# EAGLE schematic robot_general_purpose_board (EAGLE 7.1.0)
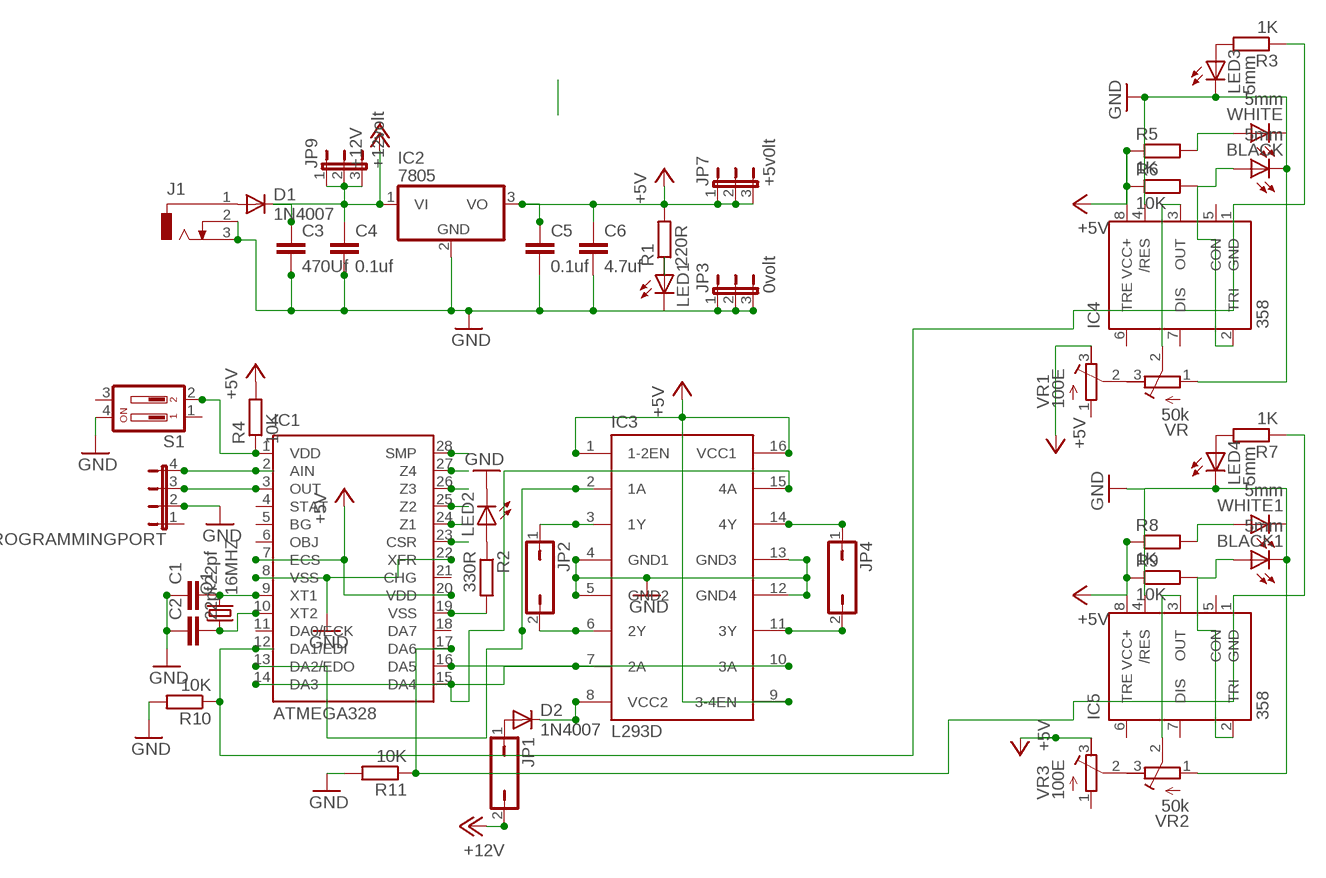
[diagram p0: schematic, sheet 1]

## Parts
BLACK  5mm  LED5MM  [LED5MM]
BLACK1  5mm  LED5MM  [LED5MM]
C1  22pf  C2.5/2  [C2.5-2]
C2  22pf  C2.5/2  [C2.5-2]
C3  470Uf  C2.5/2  [C2.5-2]
C4  0.1uf  C2.5/2  [C2.5-2]
C5  0.1uf  C2.5/2  [C2.5-2]
C6  4.7uf  C2.5/2  [C2.5-2]
D1  1N4007  1N4004  [DO41-10]
D2  1N4007  1N4004  [DO41-10]
IC1  ATMEGA328  QT9701BD  [DIL28-3]
IC2  7805  786TV  [TO220V]
IC3  L293D  [DIL16]
IC4  358  NE555  [DIL-08]
IC5  358  NE555  [DIL-08]
J1  DCJ0303  [DCJ0303]
JP1  JP1Q  [JP1]
JP2  JP1Q  [JP1]
JP3  0volt  JP2E  [JP2]
JP4  JP1Q  [JP1]
JP7  +5v0lt  JP2E  [JP2]
JP9  +12volt  JP2E  [JP2]
LED1  LED3MM  [LED3MM]
LED2  LED3MM  [LED3MM]
LED3  5mm  LED5MM  [LED5MM]
LED4  5mm  LED5MM  [LED5MM]
PROGRAMMINGPORT  JP4E  [JP4]
Q1  16MHZ  CRYSTALHC49S  [HC49/S]
R1  220R  R-EU_0207/10  [0207/10]
R2  330R  R-EU_0207/10  [0207/10]
R3  1K  R-EU_0204/7  [0204/7]
R4  10K  R-EU_0207/10  [0207/10]
R5  1K  R-EU_0204/7  [0204/7]
R6  10K  R-EU_0204/7  [0204/7]
R7  1K  R-EU_0204/7  [0204/7]
R8  1K  R-EU_0204/7  [0204/7]
R9  10K  R-EU_0204/7  [0204/7]
R10  10K  R-EU_0207/10  [0207/10]
R11  10K  R-EU_0207/10  [0207/10]
S1  DP02  [DP-02]
VR  50k  R-TRIMM64P  [RTRIM64P]
VR1  100E  R-TRIMM64P  [RTRIM64P]
VR2  50k  R-TRIMM64P  [RTRIM64P]
VR3  100E  R-TRIMM64P  [RTRIM64P]
WHITE  5mm  LED5MM  [LED5MM]
WHITE1  5mm  LED5MM  [LED5MM]

## Nets
+5V: C5.1 C6.1 IC1.7(ECS) IC1.20(VDD) IC2.3(VO) IC3.1(1-2EN) IC3.9(3-4EN) IC3.16(VCC1) IC4.8(VCC+) IC5.8(VCC+) JP7.1 JP7.2 JP7.3 R1.2 R4.2 R5.1 R6.1 R8.1 R9.1 VR1.3(A) VR3.3(A)
+12V: C3.1 C4.1 D1.C IC2.1(VI) JP1.2 JP9.1 JP9.2 JP9.3
GND: BLACK1.K(C) BLACK.K(C) C1.1 C2.1 C3.2 C4.2 C5.2 C6.2 IC1.8(VSS) IC1.22(XFR) IC2.2(GND) IC3.4(GND1) IC3.5(GND2) IC3.12(GND4) IC3.13(GND3) IC4.4(/RES) IC5.4(/RES) J1.2 J1.3 JP3.1 JP3.2 JP3.3 LED1.K(C) LED2.K(C) LED3.K(C) LED4.K(C) PROGRAMMINGPORT.2 R10.2 R11.2 S1.4 VR2.1(E) VR.1(E) WHITE1.K(C) WHITE.K(C)
N$1: C1.2 IC1.9(XT1) Q1.2
N$2: C2.2 IC1.10(XT2) Q1.1
N$3: D1.A J1.1
N$5: LED2.A R2.1
N$6: LED1.A R1.1
N$7: D2.C IC3.8(VCC2)
N$8: IC1.28(SMP)
N$9: IC1.27(Z4)
N$10: IC1.26(Z3)
N$11: IC1.25(Z2)
N$12: IC1.24(Z1)
N$13: IC1.23(CSR)
N$14: D2.A JP1.1
N$15: IC3.14(4Y) JP4.1
N$16: IC3.11(3Y) JP4.2
N$17: IC3.3(1Y) JP2.1
N$18: IC3.6(2Y) JP2.2
N$19: IC1.2(AIN) PROGRAMMINGPORT.4
N$20: IC1.12(DA1/EDI) IC4.1(GND) R3.1 R10.1
N$21: R5.2 WHITE.A
N$22: BLACK.A IC4.2(TRI) R6.2
N$23: IC1.15(DA4) IC3.15(4A)
N$24: IC1.16(DA5) IC3.10(3A)
N$25: IC1.14(DA3) IC3.7(2A)
N$26: IC1.17(DA6) IC5.1(GND) R7.1 R11.1
N$27: IC1.19(VSS) R2.2
N$28: IC4.3(OUT) VR.2(S)
N$29: VR1.2(S) VR.3(A)
N$30: IC1.3(OUT) PROGRAMMINGPORT.3
N$31: IC1.1(VDD) R4.1 S1.2
N$32: LED3.A R3.2
N$33: IC1.13(DA2/EDO) IC3.2(1A)
N$35: R8.2 WHITE1.A
N$36: BLACK1.A IC5.2(TRI) R9.2
N$37: IC5.3(OUT) VR2.2(S)
N$38: VR2.3(A) VR3.2(S)
N$40: LED4.A R7.2
Unconnected: IC1.4(STAT) IC1.5(BG) IC1.6(OBJ) IC1.11(DA0/ECK) IC1.18(DA7) IC1.21(CHG) IC4.5(CON) IC4.6(TRE) IC4.7(DIS) IC5.5(CON) IC5.6(TRE) IC5.7(DIS) PROGRAMMINGPORT.1 S1.1 S1.3 VR1.1(E) VR3.1(E)

## Library data of the parts
BLACK BLACK1 LED1-LED4 WHITE WHITE1 = led:LED: LED OSRAM: - CHIPLED LG R971, LG N971, LY N971, LG Q971, LY Q971, LO R971, LY R971 LH N974, LH R974 LS Q976, LO Q976, LY Q976 LO Q996 - Hyper CHIPLED LW Q18S LB Q993, LB Q99A, LB R99A - SideLED LS A670, LO A670, LY A670, LG A670, LP A670 LB A673, LV A673, LT A673, LW A673 LH A674 LY A675 LS A676, LA A676, LO A676, LY A676, LW A676 LS A679, LY A679, LG A679 - Hyper Micro SIDELED® LS Y876, LA Y876, LO Y876, LY Y876 LT Y87S - SmartLED LW L88C, LW L88S LB L89C, LB L89S, LG L890 LS L89K, LO L89K, LY L89K LS L896, LA L896, LO L896, LY L896 - TOPLED LS T670, LO T670, LY T670, LG T670, LP T670 LSG T670, LSP T670, LSY T670, LOP T670, LYG T670 LG T671, LOG T671, LSG T671 LB T673, LV T673, LT T673, LW T673 LH T674 LS T676, LA T676, LO T676, LY T676, LB T676, LH T676, LSB T676, LW T676 LB T67C, LV T67C, LT T67C, LS T67K, LO T67K, LY T67K, LW E67C LS E67B, LA E67B, LO E67B, LY E67B, LB E67C, LV E67C, LT E67C LW T67C LS T679, LY T679, LG T679 LS T770, LO T770, LY T770, LG T770, LP T770 LB T773, LV T773, LT T773, LW T773 LH T774 LS E675, LA E675, LY E675, LS T675 LS T776, LA T776, LO T776, LY T776, LB T776 LHGB T686 LT T68C, LB T68C - Hyper Mini TOPLED® LB M676 - Mini TOPLED Santana® LG M470 LS M47K, LO M47K, LY M47K Source: http://www.osram.convergy.de LUXEON: - LUMILED® LXK2-PW12-R00, LXK2-PW12-S00, LXK2-PW14-U00, LXK2-PW14-V00 LXK2-PM12-R00, LXK2-PM12-S00, LXK2-PM14-U00 LXK2-PE12-Q00, LXK2-PE12-R00, LXK2-PE12-S00, LXK2-PE14-T00, LXK2-PE14-U00 LXK2-PB12-K00, LXK2-PB12-L00, LXK2-PB12-M00, LXK2-PB14-N00, LXK2-PB14-P00, LXK2-PB14-Q00 LXK2-PR12-L00, LXK2-PR12-M00, LXK2-PR14-Q00, LXK2-PR14-R00 LXK2-PD12-Q00, LXK2-PD12-R00, LXK2-PD12-S00 LXK2-PH12-R00, LXK2-PH12-S00 LXK2-PL12-P00, LXK2-PL12-Q00, LXK2-PL12-R00 Source: www.luxeon.com KINGBRIGHT: KA-3528ASYC Source: www.kingbright.com
C1-C6 = capacitor-wima:C: CAPACITOR naming: grid - package width
D1 D2 = diode:1N4004: DIODE general purpose rectifier, 1 A
IC1 = quantum-research-group:QT9701B: Charge-Transfer Capacitance Sensor IC Source: http://data.qprox.com/downloads/datasheets/qt9701b.pdf; OC_FARNELL: unknown; OC_NEWARK: unknown
IC2 = linear:78*: Positive VOLTAGE REGULATOR Source: http://cache.national.com/ds/LM/LM78L05.pdf http://www.fairchildsemi.com/ds/LM/LM7805.pdf
IC3 = st-microelectronics:L293D: PUSH-PULL 4 CHANNEL DRIVER; MPN: L293D; OC_FARNELL: 9589619; OC_NEWARK: 56P8249
IC4 IC5 = st-microelectronics:NE555: General purpose bipolar Timer; MF: Arrow Electronics; MPN: NE555N; OC_FARNELL: 1467742; OC_NEWARK: 89K1486
J1 = con-jack:DCJ0303: DC POWER JACK Source: DCJ0303.pdf; OC_FARNELL: unknown; OC_NEWARK: unknown
JP1 JP2 JP4 = jumper:JP1Q: JUMPER
JP3 JP7 JP9 = jumper:JP2E: JUMPER
PROGRAMMINGPORT = jumper:JP4E: JUMPER
Q1 = crystal:CRYSTAL: CRYSTAL; OC_FARNELL: 1667008; OC_NEWARK: unknown
R1-R11 = rcl:R-EU_: RESISTOR, European symbol
S1 = switch-dil:DP02: DIL/CODE SWITCH; MPN: MCDP02; OC_FARNELL: 1255233; OC_NEWARK: 26M1095
VR VR1-VR3 = resistor:R-TRIMM: Trimm resistor